# EAGLE design EH4a-midi-v1.4 (poprawiona na przyszłość) (EAGLE 8.6.3)
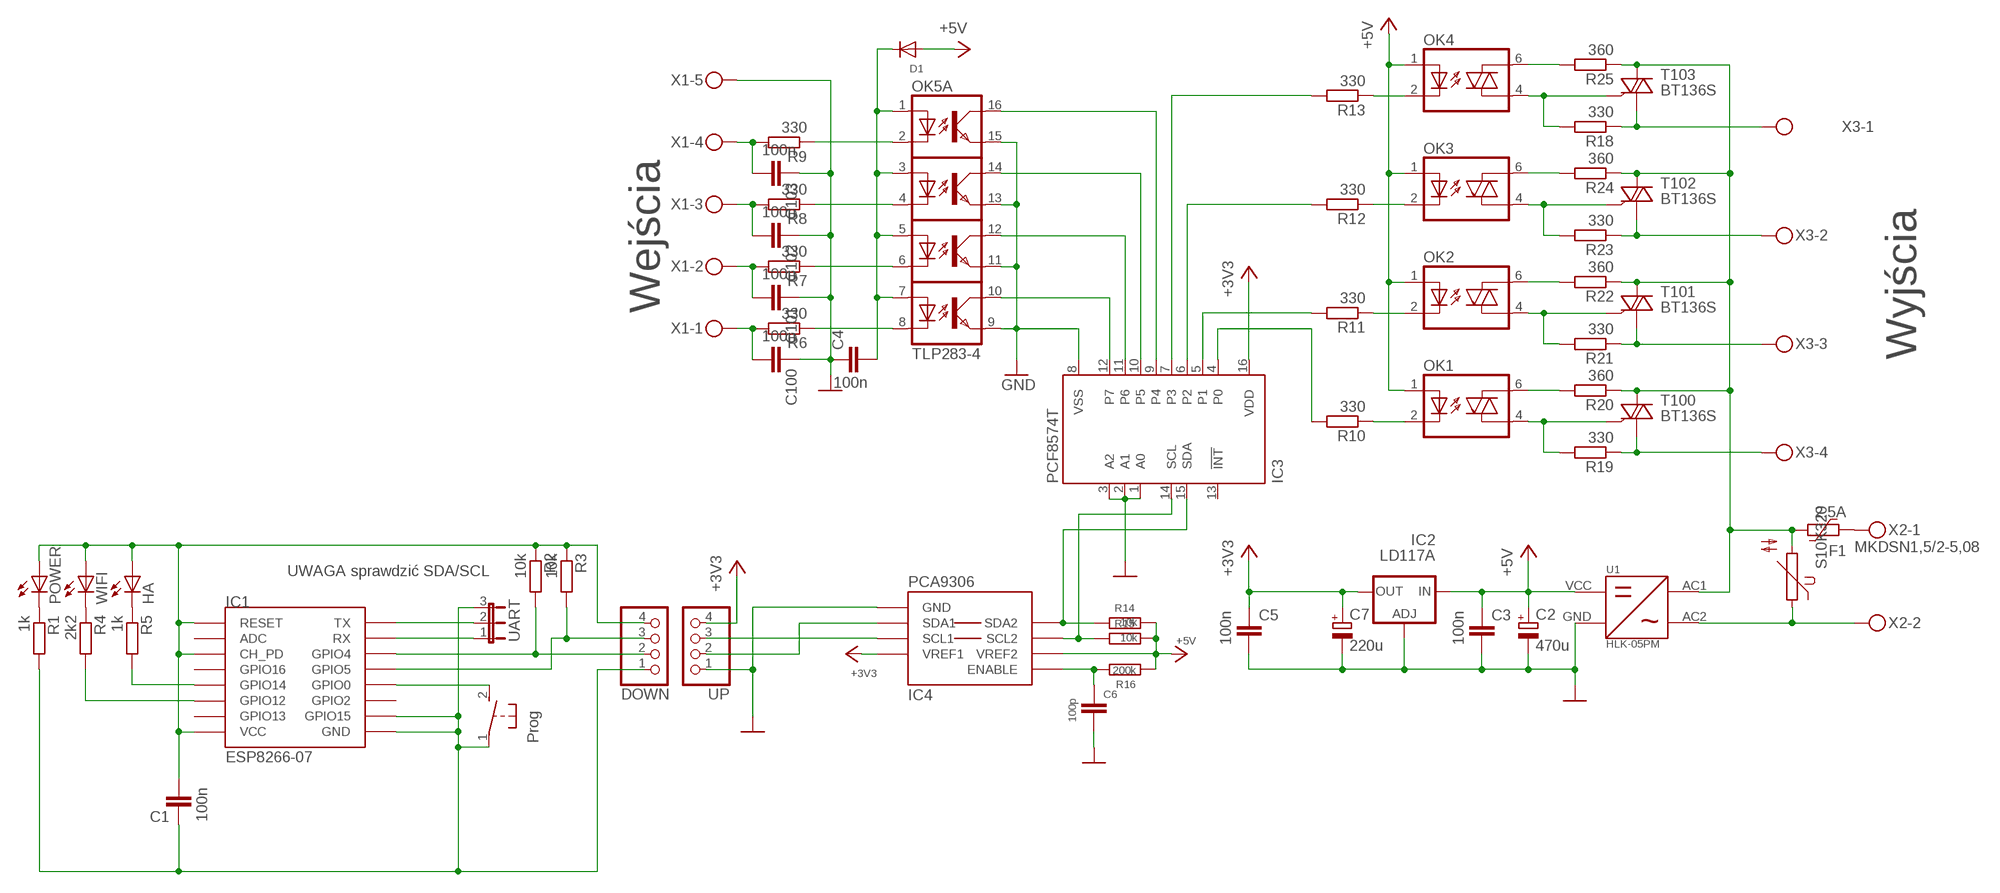
[diagram p0: schematic, sheet 1]

## Parts
C1  100n  C-EUC0805  [C0805]
C2  470u  CPOL-EUE3.5-8  [E3,5-8]
C3  100n  C-EUC0805  [C0805]
C4  100n  C-EUC0805  [C0805]
C5  100n  C-EUC0805  [C0805]
C6  100p  C-EUC0805  [C0805]
C7  220u  CPOL-EUE2.5-7  [E2,5-7]
C100  100n  C-EUC0805  [C0805]
C101  100n  C-EUC0805  [C0805]
C102  100n  C-EUC0805  [C0805]
C103  100n  C-EUC0805  [C0805]
D1  1N4148  DIODESOD-123  [SOD-123]
DOWN  PINHD-1X4  [1X04]
F1  2.5A  2920L700SL  [2920L]
HA  LED3MM  [LED3MM]
IC1  ESP8266-07  ESP12  [ESP12]
IC2  LD117A  LD117AS12TR  [SOT223]
IC3  PCF8574T  [SO16W]
IC4  PCA9306  IC2_LEVEL_TRANSLATER  [MSOP08]
OK1  MOC3043  IL420  [DIL06]
OK2  IL420  [DIL06]
OK3  IL420  [DIL06]
OK4  IL420  [DIL06]
OK5  TLP283-4  [MINI-FLAT-16]
POWER  LED3MM  [LED3MM]
R1  1k  R-EU_M0805  [M0805]
R2  10k  R-EU_M0805  [M0805]
R3  10k  R-EU_M0805  [M0805]
R4  2k2  R-EU_M0805  [M0805]
R5  1k  R-EU_M0805  [M0805]
R6  330  R-EU_M0805  [M0805]
R7  330  R-EU_M0805  [M0805]
R8  330  R-EU_M0805  [M0805]
R9  330  R-EU_M0805  [M0805]
R10  330  R-EU_M0805  [M0805]
R11  330  R-EU_M0805  [M0805]
R12  330  R-EU_M0805  [M0805]
R13  330  R-EU_M0805  [M0805]
R14  10k  R-EU_R0805  [R0805]
R15  10k  R-EU_R0805  [R0805]
R16  200k  R-EU_R0805  [R0805]
R17  S10K320  [S10K320]
R18  330  R-EU_R1210  [R1210]
R19  330  R-EU_R1210  [R1210]
R20  360  R-EU_R1210  [R1210]
R21  330  R-EU_R1210  [R1210]
R22  360  R-EU_R1210  [R1210]
R23  330  R-EU_R1210  [R1210]
R24  360  R-EU_R1210  [R1210]
R25  360  R-EU_R1210  [R1210]
S1  Prog  DTSM-3  [DTSM-3]
T100  BT136S  ACT108WDPAK  [SOT428]
T101  BT136S  ACT108WDPAK  [SOT428]
T102  BT136S  ACT108WDPAK  [SOT428]
T103  BT136S  ACT108WDPAK  [SOT428]
U1  HLK-05PM  HLK-PM01_HLK-PM01  [HLK-PM01_HLK-PM01]
UART  JP2E  [JP2]
UP  PINHD-1X4  [1X04]
WIFI  LED3MM  [LED3MM]
X1  MKDSN1,5/5-5,08  [MKDSN1,5/5-5,08]
X2  MKDSN1,5/2-5,08  [MKDSN1,5/2-5,08]
X3  MKDSN1,5/4-5,08  [MKDSN1,5/4-5,08]

## Nets
3V3: C1.2 DOWN.4 HA.A IC1.CH_PD IC1.RESET IC1.VCC POWER.A R2.1 R3.1 WIFI.A
+3V3: C5.1 C7.+ IC2.2(OUT) IC2.4(OUT) IC3.16(VDD) IC4.2(VREF1) UP.4
+5V: C2.+ C3.1 D1.A IC2.3(IN) IC4.7(VREF2) OK1.1(A) OK2.1(A) OK3.1(A) OK4.1(A) R14.1 R15.1 R16.2 U1.VCC
GND: C2.- C3.2 C4.1 C5.2 C6.2 C7.- C100.1 C101.1 C102.1 C103.1 IC2.1(ADJ) IC3.1(A0) IC3.2(A1) IC3.3(A2) IC3.8(VSS) IC4.1(GND) OK5.9(D:EMIT) OK5.11(C:EMIT) OK5.13(B:EMIT) OK5.15(A:EMIT) U1.GND UP.1 X1.5
GND1: C1.1 DOWN.1 IC1.GND IC1.GPIO15 R1.2 S1.1 UART.3
L: F1.1 R17.2 R20.1 R22.1 R24.1 R25.1 T100.MB(LD) T101.MB(LD) T102.MB(LD) T103.MB(LD) U1.AC1
N$1: IC3.7(P3) R13.2
N$2: IC3.10(P5) OK5.14(B:COL)
N$3: IC3.11(P6) OK5.12(C:COL)
N$4: IC3.12(P7) OK5.10(D:COL)
N$5: IC3.6(P2) R12.2
N$6: OK4.2(C) R13.1
N$7: OK1.2(C) R10.1
N$8: OK2.2(C) R11.1
N$9: IC3.5(P1) R11.2
N$10: IC3.4(P0) R10.2
N$11: IC1.GPIO14 R5.2
N$13: R17.1 U1.AC2 X2.2
N$14: C103.2 R9.2 X1.4
N$15: C102.2 R8.2 X1.3
N$16: F1.2 X2.1
N$19: POWER.K(C) R1.1
N$20: R4.1 WIFI.K(C)
N$21: HA.K(C) R5.1
N$22: IC1.GPIO12 R4.2
N$25: IC1.GPIO0 S1.2
N$26: IC1.RX UART.1
N$27: IC1.TX UART.2
N$29: C6.1 IC4.8(ENABLE) R16.1
N$32: IC3.9(P4) OK5.16(A:COL)
N$39: OK3.2(C) R12.1
N$49: C4.2 D1.C OK5.1(A:A) OK5.3(B:A) OK5.5(C:A) OK5.7(D:A)
N$50: OK5.2(A:C) R9.1
N$51: OK5.4(B:C) R8.1
N$52: OK5.6(C:C) R7.1
N$53: OK5.8(D:C) R6.1
N$54: OK1.4(A1) R19.2 T100.3(G)
N$55: R19.1 T100.1(CM) X3.4
N$56: C101.2 R7.2 X1.2
N$57: C100.2 R6.2 X1.1
N$59: OK2.4(A1) R21.2 T101.3(G)
N$60: R21.1 T101.1(CM) X3.3
N$64: OK3.4(A1) R23.2 T102.3(G)
N$65: R23.1 T102.1(CM) X3.2
N$69: OK4.4(A1) R18.2 T103.3(G)
N$70: R18.1 T103.1(CM) X3.1
N$74: OK4.6(A2) R25.2
N$75: OK3.6(A2) R24.2
N$76: OK2.6(A2) R22.2
N$77: OK1.6(A2) R20.2
SCL: IC3.14(SCL) IC4.6(SCL2) R15.2
SCL1: DOWN.3 IC1.GPIO5 R3.2
SCL': IC4.3(SCL1) UP.3
SDA: IC3.15(SDA) IC4.5(SDA2) R14.2
SDA1: DOWN.2 IC1.GPIO4 R2.2
SDA': IC4.4(SDA1) UP.2
Unconnected: IC1.ADC IC1.GPIO2 IC1.GPIO13 IC1.GPIO16 IC3.13(!INT)

## Notes on the sheet
- Wejścia
- Wyjścia
- UWAGA sprawdzić SDA/SCL

## Library data of the parts
C1 C3-C6 C100-C103 = rcl:C-EU: CAPACITOR, European symbol
C2 C7 = rcl:CPOL-EU: POLARIZED CAPACITOR, European symbol; SPICEPREFIX: C
D1 = adafruit:DIODE: Diode SMADIODE - SMA Surface Mount Package 20V 1A Schottky Diode Digikey: 641-1014-6-ND DO-1N4148 - Through Hole Small Current Diode SOD-123 20V 1 A (.5mV Vf) Schottky Diode - Digikey: MBRX120TPMSCT-ND SOD-323 10V 570mA (.38mV Vf, 3ns) Schottky Diode - Digikey: ZLLS410CT-ND SOD-523 30V 30mA Schottky Diode (RB751S-40TE61) - Digikey: RB751S-40TE61CT-ND SOT23-R/W - SOT23 Package (R = Solder Paste/Reflow Ovens, W = Hand-Soldering) BAT54Film 40V 300mA - Digikey: 497-7162-1-ND
DOWN UP = pinhead:PINHD-1X4: PIN HEADER
F1 = polyfuse-smd_20:?: Polyfuse Resettable PTC Source: http://www.littelfuse.com/products/resettable-ptcs.aspx; MF: Littelfuse; MPN: 2920L700SL; OC_FARNELL: unknown; OC_NEWARK: 69W6461
HA POWER WIFI = led:LED: LED OSRAM: - CHIPLED LG R971, LG N971, LY N971, LG Q971, LY Q971, LO R971, LY R971 LH N974, LH R974 LS Q976, LO Q976, LY Q976 LO Q996 - Hyper CHIPLED LW Q18S LB Q993, LB Q99A, LB R99A - SideLED LS A670, LO A670, LY A670, LG A670, LP A670 LB A673, LV A673, LT A673, LW A673 LH A674 LY A675 LS A676, LA A676, LO A676, LY A676, LW A676 LS A679, LY A679, LG A679 - Hyper Micro SIDELED® LS Y876, LA Y876, LO Y876, LY Y876 LT Y87S - SmartLED LW L88C, LW L88S LB L89C, LB L89S, LG L890 LS L89K, LO L89K, LY L89K LS L896, LA L896, LO L896, LY L896 - TOPLED LS T670, LO T670, LY T670, LG T670, LP T670 LSG T670, LSP T670, LSY T670, LOP T670, LYG T670 LG T671, LOG T671, LSG T671 LB T673, LV T673, LT T673, LW T673 LH T674 LS T676, LA T676, LO T676, LY T676, LB T676, LH T676, LSB T676, LW T676 LB T67C, LV T67C, LT T67C, LS T67K, LO T67K, LY T67K, LW E67C LS E67B, LA E67B, LO E67B, LY E67B, LB E67C, LV E67C, LT E67C LW T67C LS T679, LY T679, LG T679 LS T770, LO T770, LY T770, LG T770, LP T770 LB T773, LV T773, LT T773, LW T773 LH T774 LS E675, LA E675, LY E675, LS T675 LS T776, LA T776, LO T776, LY T776, LB T776 LHGB T686 LT T68C, LB T68C - Hyper Mini TOPLED® LB M676 - Mini TOPLED Santana® LG M470 LS M47K, LO M47K, LY M47K Source: http://www.osram.convergy.de LUXEON: - LUMILED® LXK2-PW12-R00, LXK2-PW12-S00, LXK2-PW14-U00, LXK2-PW14-V00 LXK2-PM12-R00, LXK2-PM12-S00, LXK2-PM14-U00 LXK2-PE12-Q00, LXK2-PE12-R00, LXK2-PE12-S00, LXK2-PE14-T00, LXK2-PE14-U00 LXK2-PB12-K00, LXK2-PB12-L00, LXK2-PB12-M00, LXK2-PB14-N00, LXK2-PB14-P00, LXK2-PB14-Q00 LXK2-PR12-L00, LXK2-PR12-M00, LXK2-PR14-Q00, LXK2-PR14-R00 LXK2-PD12-Q00, LXK2-PD12-R00, LXK2-PD12-S00 LXK2-PH12-R00, LXK2-PH12-S00 LXK2-PL12-P00, LXK2-PL12-Q00, LXK2-PL12-R00 Source: www.luxeon.com KINGBRIGHT: KA-3528ASYC Source: www.kingbright.com
IC1 = esp8266modules:ESP12: ESP8266 Wifi module 12
IC2 = v-reg:LD117A?*: Low drop fixed and adjustable positive voltage regulators 1 A Source: http://www.st.com/stonline/products/literature/ds/7194/ld1117axx.pdf
IC3 = micro-philips:PCF8574: I2C-Bus Remote 8-bit I/O expander http://www.semiconductors.philips.com/acrobat_download/datasheets/PCF8574_4.pdf; MPN: PCF8574T/3,512; OC_FARNELL: 1201255; OC_NEWARK: 70R6870
IC4 = srg:IC2_LEVEL_TRANSLATER: I2C Level Translator PCA9306 Data Sheet <http://www.ti.com/lit/ds/symlink/pca9306.pdf> Sparkfun breakout board schematic <http://dlnmh9ip6v2uc.cloudfront.net/datasheets/BreakoutBoards/PCA9306_Breakout.pdf>
OK1-OK4 = optocoupler:IL420: SIEMENS OPTO COUPLER
OK5 = optocoupler:TLP283-4: TOSHIBA PHOTOCOUPLER GaAs IRED & PHOTO-TRANSISTOR Source: http://www.semicon.toshiba.co.jp/td/en/Opto/Photocoupler/en_20050928_TLP283_datasheet.pdf; OC_FARNELL: unknown; OC_NEWARK: unknown
R1-R13 = rcl:R-EU_: RESISTOR, European symbol; SPICEPREFIX: R
R14-R16 R18-R25 = rcl:R-EU_: RESISTOR, European symbol
R17 = varistor:S10K320: VARISTOR
S1 = switch-tact:DTSM-3
T100-T103 = nxp_60:ACT108W: AC Thyristor power switch AC Thyristor power switch in a SOT223 surface-mountable plastic package with self-protective capabilities against low and high energy transients AAL Eindhoven MK
U1 = HLK-PM:HLK-PM01_HLK-PM01: HLK-PM05
UART = jumper:JP2E: JUMPER
X1 = con-phoenix-508:MKDSN1,5/5-5,08: MKDSN 1,5/ 5-5,08 Printklemme Nennstrom: 13,5 A Nennspannung: 250 V Rastermaß: 5,08 mm Polzahl: 5 Anschlussart: Schraubanschluss Montage: Löten Anschlussrichtung Leiter/Platine: 0 ° Artikelnummer: 1729157 Source: http://eshop.phoenixcontact.com .. 1729157.pdf
X2 = con-phoenix-508:MKDSN1,5/2-5,08: MKDSN 1,5/ 2-5,08 Printklemme Nennstrom: 13,5 A Nennspannung: 250 V Rastermaß: 5,08 mm Polzahl: 2 Anschlussart: Schraubanschluss Montage: Löten Anschlussrichtung Leiter/Platine: 0 ° Artikelnummer: 1729128 Source: http://eshop.phoenixcontact.com .. 1729128.pdf
X3 = con-phoenix-508:MKDSN1,5/4-5,08: MKDSN 1,5/ 4-5,08 Printklemme Nennstrom: 13,5 A Nennspannung: 250 V Rastermaß: 5,08 mm Polzahl: 4 Anschlussart: Schraubanschluss Montage: Löten Anschlussrichtung Leiter/Platine: 0 ° Artikelnummer: 1729144 Source: http://eshop.phoenixcontact.com .. 1729144.pdf

## Board
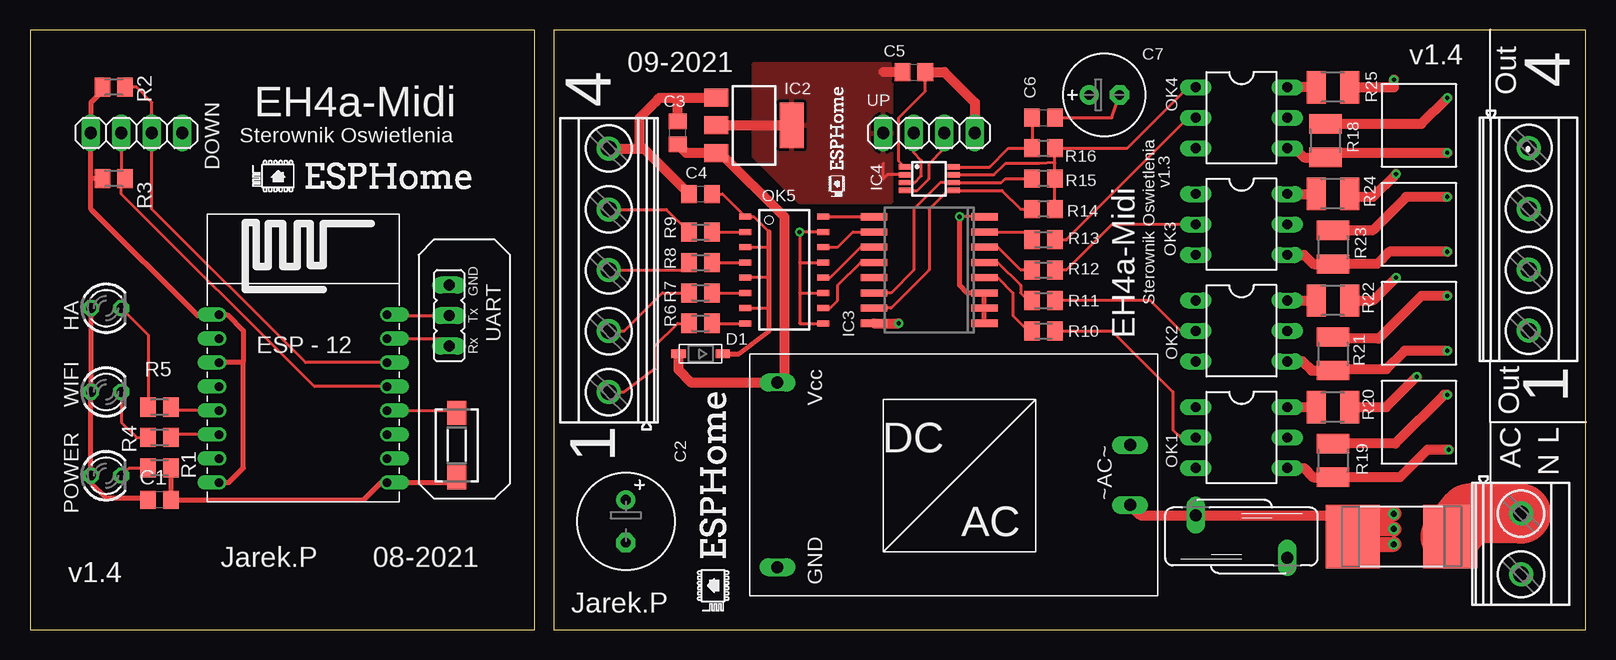
[diagram p1: board, top side]
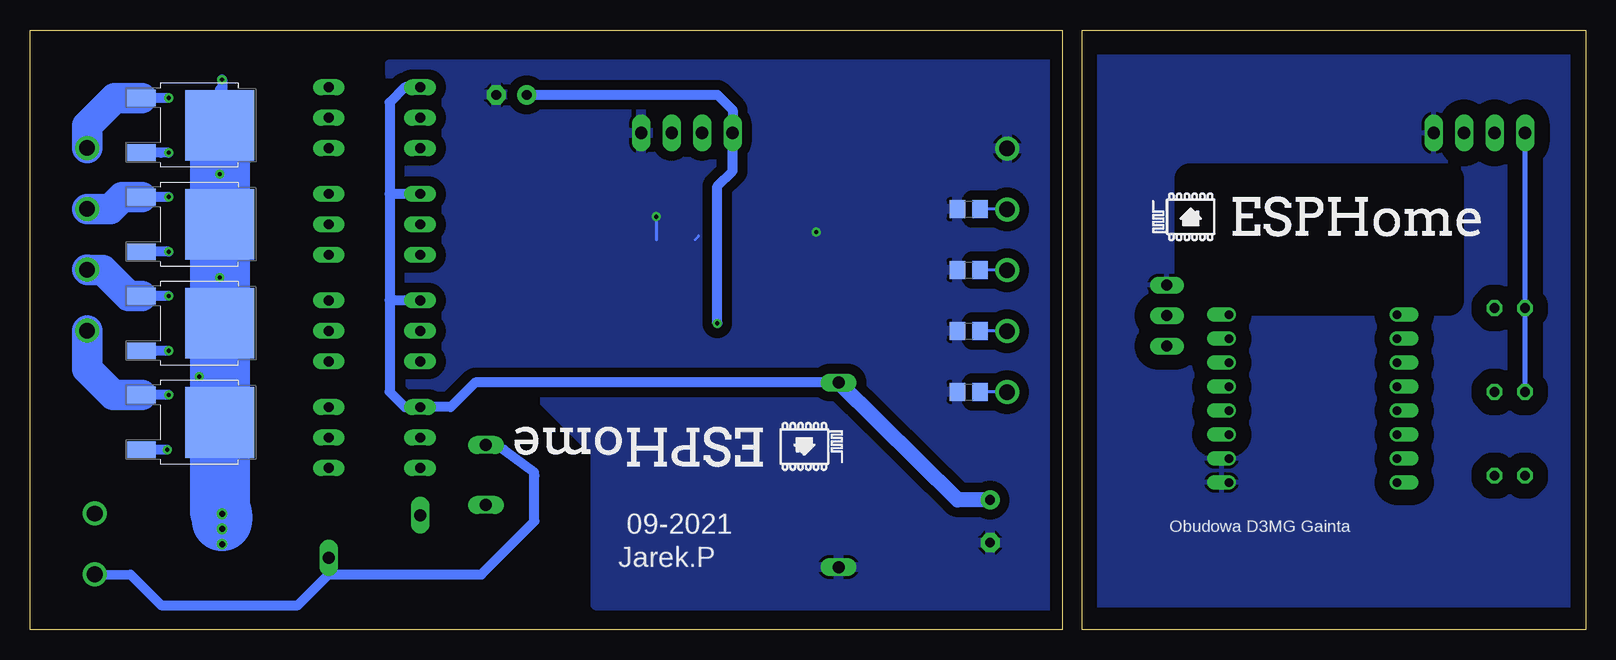
[diagram p2: board, bottom side, seen from below]

Size 129.66 x 50 mm. Coordinates in mm from the lower left corner, seen from the top.
Outline: 129.66,0 129.66,50 43.63,50 43.63,0 129.66,0
Outline: 42,50 42,0 0,0 0,50 42,50
Copper layers (1*16): Top 0.035mm / dielectric 1.5mm / Bottom 0.035mm
Design rules "default *": minimum track width 10mil, minimum drill 10mil, track to track 8mil, track to pad 8mil, pad to pad 6mil, via to via 8mil, smd to smd 6mil, copper to edge 40mil, drill to drill 8mil, minimum pad ring 10mil, minimum via ring 8mil, stop-mask expansion 4mil, vias tented up to drill 0mil, thermal gap 10mil
bRestrict: area 11.4,27.4 to 33,37.6

### Footprints (pad centres in the part's own frame; a part is rotated, then mirrored left to right if it is on the bottom)
C0805 = smd 1.3 x 1.5: 1 -0.95,0; 2 0.95,0
E3,5-8 = drill 0.813 pad 1.6: + -1.778,0 | drill 0.813 pad 1.6 octagon: - 1.778,0
E2,5-7 = drill 0.813 pad 1.6: + -1.27,0 | drill 0.813 pad 1.6 octagon: - 1.27,0
SOD-123 = smd 1.2 x 0.7: A 1.85,0; C -1.85,0
1X04 = drill 1.016 long: 1 -3.81,0; 2 -1.27,0; 3 1.27,0; 4 3.81,0
2920L = smd 4.5 x 5.3: 1 -2.792,0; 2 5.332,0
LED3MM = drill 0.813 octagon: A -1.27,0; K 1.27,0
ESP12 = drill 0.7 offset: ADC -7.1,3.8; CH_PD -7.1,1.8; GND 6.9,-8.2; GPIO0 6.9,-2.2; GPIO2 6.9,-4.2; GPIO4 6.9,1.8; GPIO5 6.9,-0.2; GPIO12 -7.1,-4.2; GPIO13 -7.1,-6.2; GPIO14 -7.1,-2.2; GPIO15 6.9,-6.2; GPIO16 -7.1,-0.2; RESET -7.1,5.8; RX 6.9,3.8; TX 6.9,5.8; VCC -7.1,-8.2
SOT223 = smd 1.5 x 2: 1 -2.3,-3.15; 2 0,-3.15; 3 2.3,-3.15 | smd 3.8 x 2: 4 0,3.15
SO16W = smd 0.6 x 2.2: 1 -4.445,-4.6; 2 -3.175,-4.6; 3 -1.905,-4.6; 4 -0.635,-4.6; 5 0.635,-4.6; 6 1.905,-4.6; 7 3.175,-4.6; 8 4.445,-4.6; 9 4.445,4.6; 10 3.175,4.6; 11 1.905,4.6; 12 0.635,4.6; 13 -0.635,4.6; 14 -1.905,4.6; 15 -3.175,4.6; 16 -4.445,4.6
MSOP08 = smd 0.45 x 1: 1 -0.975,-2.05; 2 -0.325,-2.05; 3 0.325,-2.05; 4 0.975,-2.05; 5 0.975,2.05; 6 0.325,2.05; 7 -0.325,2.05; 8 -0.975,2.05
DIL06 = drill 0.813 long: 1 -2.54,-3.81; 2 0,-3.81; 3 2.54,-3.81; 4 2.54,3.81; 5 0,3.81; 6 -2.54,3.81
MINI-FLAT-16 = smd 1 x 0.5: 1 -3.24,4.445; 2 -3.24,3.175; 3 -3.24,1.905; 4 -3.24,0.635; 5 -3.24,-0.635; 6 -3.24,-1.905; 7 -3.24,-3.175; 8 -3.24,-4.445; 9 3.24,-4.445; 10 3.24,-3.175; 11 3.24,-1.905; 12 3.24,-0.635; 13 3.24,0.635; 14 3.24,1.905; 15 3.24,3.175; 16 3.24,4.445
M0805 = smd 1.3 x 1.6: 1 -0.95,0; 2 0.95,0
R0805 = smd 1.3 x 1.5: 1 -0.95,0; 2 0.95,0
S10K320 = drill 1.016 long: 1 -1.778,-3.81; 2 1.778,3.81
R1210 = smd 1.6 x 2.7: 1 -1.4,0; 2 1.4,0
DTSM-3 = smd 2 x 1.6: 1 -2.7,0; 2 2.7,0
SOT428 = smd 1.4 x 2.4: 1 -2.285,-4.8; 3 2.285,-4.8 | smd 5.9 x 5.75: MB 0,1.725
HLK-PM01_HLK-PM01 = drill 1 long: AC1 -14.21,2.44; AC2 -14.21,-2.56; GND 15.19,7.64; VCC 15.19,-7.76
JP2 = drill 0.914 long: 1 -2.54,0; 2 0,0; 3 2.54,0
MKDSN1,5/5-5,08 = drill 1.3 pad 2: 1 -10.181,0.025; 2 -5.101,0.025; 3 -0.021,0.025; 4 5.059,0.025; 5 10.139,0.025
MKDSN1,5/2-5,08 = drill 1.3 pad 2: 1 -2.561,0.025; 2 2.519,0.025
MKDSN1,5/4-5,08 = drill 1.3 pad 2: 1 -7.641,0.025; 2 -2.561,0.025; 3 2.519,0.025; 4 7.599,0.025

### Placement (x,y rotation side)
C1  10.79,10.8 180 top
C2  49.65,9.03 270 top
C3  53.97,41.41 90 top
C4  55.88,36.33 0 top
C5  73.66,46.49 0 top
C6  84.45,42.68 0 top
C7  89.53,44.59 0 top
C100  51.43,19.82 0 bottom
C101  51.43,24.9 0 bottom
C102  51.43,29.98 0 bottom
C103  51.43,35.06 0 bottom
D1  55.88,23 180 top
DOWN  8.88,41.41 180 top
F1  113.02,7.76 0 top
HA  6.34,26.8 0 top
IC1  22.85,20.45 0 top
IC2  60.32,42.05 270 top
IC3  74.92,29.98 90 top
IC4  74.92,37.6 270 top
OK1  100.96,16.01 270 top
OK2  100.96,24.9 270 top
OK3  100.96,33.79 270 top
OK4  100.96,42.68 270 top
OK5  62.86,29.98 0 top
POWER  6.34,12.84 0 top
R1  10.79,13.47 0 top
R2  6.98,45.22 0 top
R3  6.98,37.6 0 top
R4  10.79,16.01 0 top
R5  10.79,18.55 0 top
R6  55.88,25.54 180 top
R7  55.88,28.07 180 top
R8  55.88,30.61 180 top
R9  55.88,33.16 180 top
R10  84.45,24.9 180 top
R11  84.45,27.44 180 top
R12  84.45,29.98 180 top
R13  84.45,32.52 180 top
R14  84.45,35.06 180 top
R15  84.45,37.6 180 top
R16  84.45,40.14 0 top
R17  100.96,7.76 90 top
R18  107.94,40.77 270 top
R19  108.58,14.11 270 top
R20  108.58,18.55 180 top
R21  108.58,23 270 top
R22  108.58,27.44 180 top
R23  108.58,31.88 270 top
R24  108.58,36.33 180 top
R25  108.58,45.22 180 top
S1  35.55,15.38 90 top
T100  115.56,17.28 270 bottom
T101  115.56,25.54 270 bottom
T102  115.56,33.79 270 bottom
T103  115.56,42.05 270 bottom
U1  77.47,12.84 180 top
UART  34.92,26.17 90 top
UP  74.92,41.41 180 top
WIFI  6.34,19.82 0 top
X1  48.25,29.98 90 top
X2  124.24,7.12 270 top
X3  124.87,32.52 270 top

### Tracks (layer width: path | path; a pad name or v marks a point on that pad's centre or on a via)
3V3
  Top 0.406: 5.07,37.6 5.07,35.06 13.96,26.17 16.42,26.25 | 5.07,37.6 DOWN.4 5.07,43.95 6.03,44.91 R2.1 | IC1.RESET 16.42,26.25 | 16.42,26.25 17.77,24.9 17.77,22.36 | 17.77,22.36 17.67,22.25 IC1.CH_PD | IC1.VCC 16.56,12.26 17.77,13.47 17.77,22.36 | C1.2 9.71,10.93 6.34,10.93 5.07,12.2 POWER.A WIFI.A HA.A | R3.1 5.07,37.6
  Bottom 0.406: WIFI.A DOWN.4
+3V3  (via drill 0.35)
  Top 0.254: IC4.2 71.44,37.92 71.11,37.6 71.11,38.87
  Top 0.813: IC2.2 IC2.4 | C5.1 71.11,46.49 | IC3.16 v72.38,25.54
  Bottom 0.813: C7.+ 72.38,44.59 71.11,43.31 UP.4 71.11,38.23 72.38,36.97 v72.38,25.54
  pour Top: 60.32,47.12 60.32,39.51 64.13,35.7 71.75,35.7 71.75,47.12
+5V
  Top 0.254: IC4.7 80.33,37.92 81.28,38.87 84.07,38.87 85.4,38.94 | 85.4,38.94 R15.1 R14.1 | 85.4,38.94 R16.2 91.44,40.14 96.52,45.22 OK4.1
  Top 0.406: 55.11,20.58 55.38,20.59 | IC2.3 57.54,39.74 | 62.86,20.59 U1.VCC
  Top 0.813: D1.A 54.02,21.67 55.11,20.58 | 55.38,20.59 U1.VCC | 57.54,39.74 62.86,34.42 62.86,20.59 | IC2.3 54.68,39.74 C3.1
  Bottom 0.813: OK4.1 98.42,45.22 99.69,43.95 99.69,36.33 | OK3.1 99.69,36.33 | 99.69,36.33 99.69,27.44 | OK2.1 99.69,27.44 | 99.69,27.44 99.69,19.82 98.42,18.55 OK1.1 94.61,18.55 92.56,20.59 U1.VCC
  Bottom 1.27: C2.+ 52.36,10.8 U1.VCC
GND  (via drill 0.35)
  Top 0.254: OK5.15 v64.13,33.16 64.13,30.61 | 64.13,30.61 OK5.13 | 64.13,30.61 64.13,28.07 | 64.13,28.07 OK5.11 | 64.13,28.07 64.13,25.54 OK5.9 | IC3.8 v77.47,34.42 | IC4.1 72.38,39.06 72.38,42.68 74.6,44.9 C5.2 | C6.2 90.16,42.68 C7.-
  Top 0.406: IC3.1 IC3.2 IC3.3 78.1,28.07 77.47,28.71 v77.47,34.42
  Top 0.813: C4.1 51.14,40.12 X1.5 50.77,40.12 50.79,40.14 50.79,42.68 52.06,43.95 52.46,44.34 53.97,44.34 | 53.97,44.34 IC2.1 | C3.2 53.97,44.34 | C5.2 76.19,46.49 78.73,43.95 UP.1
  Bottom 0.254: v77.47,34.42 77.47,32.52 | 74.25,32.52 73.95,32.81
  pour Bottom (isolate 0.813): 44.45,2.04 44.45,47.12 99.69,47.12 99.06,19.82 87.62,19.82 82.54,14.74 82.54,2.04
GND1
  Top 0.406: S1.1 35.13,12.26 IC1.GND 29.26,12.26 27.81,10.8 C1.1 R1.2
  pour Bottom (isolate 1.27): 41.9,2.04 41.9,47.76 -0.01,47.76 -0.01,2.04
L  (via drill 0.35, 0.5)
  Top 0.813: 109.74,18.31 R20.1 113.02,18.55 v115.56,21.09 | R24.1 110.22,36.09 | 110.22,36.09 109.85,36.33 | R25.1 113.66,45.22 v113.66,45.85 | 110.22,36.09 111.92,36.09 v113.84,37.98 | R22.1 111.94,27.44 v113.84,29.34 | U1.AC1 92.54,9.53 R17.2 108.45,9.53 F1.1 111.12,7.76 | 111.75,9.66 111.75,8.39 111.12,7.76 | 111.12,7.76 111.75,7.12
  Top 1.27: 111.75,7.12 v113.66,7.12 | v113.66,8.39 111.75,8.39 | 111.75,9.66 v113.66,9.66
  Bottom 0.406: T100.MB 113.66,16.82 v115.56,21.09
  Bottom 0.813: v113.66,45.85 113.66,44.86 | 113.66,44.59 113.66,44.86 | 113.66,44.86 113.84,45.04 T103.MB
  Bottom 5: T103.MB v113.84,37.98 v113.84,29.34 | T102.MB v113.84,29.34 | v113.84,29.34 T101.MB T100.MB 113.84,9.84 v113.66,9.66 113.66,9.03
N$1
  Top 0.254: IC3.7 82.86,33.16 R13.2
N$2
  Top 0.254: IC3.10 68.57,33.16 67.3,31.88 OK5.14
N$3
  Top 0.254: OK5.12 66.67,29.34 69.21,31.88 IC3.11
N$4
  Top 0.254: OK5.10 66.67,26.8 67.3,27.44 67.3,28.71 69.21,30.61 IC3.12
N$5
  Top 0.254: IC3.6 80.64,31.88 82.54,29.98 R12.2
N$6
  Top 0.254: R13.1 86.35,32.52 96.52,42.68 OK4.2
N$7
  Top 0.254: R10.1 90.16,24.9 95.25,19.82 95.25,16.64 95.88,16.01 OK1.2
N$8
  Top 0.254: OK2.2 95.88,24.9 93.34,27.44 R11.1
N$9
  Top 0.254: IC3.5 80.64,30.61 82.54,28.71 82.54,28.07 83.18,27.44 R11.2
N$10
  Top 0.254: IC3.4 80.64,29.34 81.91,28.07 81.91,26.17 83.18,24.9 R10.2
N$11
  Top 0.254: IC1.GPIO14 11.4,18.25 R5.2
N$13
  Bottom 0.813: X2.2 121.28,4.58 118.74,2.04 107.33,2.04 104.77,4.6 | 104.77,4.6 92.05,4.6 87.62,9.03 87.62,12.84 87.64,13.11 90.16,14.99 90.82,15.39 U1.AC2 | R17.1 104.77,4.6
N$14
  Top 0.254: X1.4 53.04,35.04 R9.2
  Bottom 0.254: X1.4 48.25,35.06 C103.2
N$15
  Top 0.254: X1.3 54.27,29.96 R8.2
  Bottom 0.254: X1.3 48.25,29.98 C102.2
N$16
  Top 0.813: F1.2 118.11,7.5 118.11,5.85
  Top 5: X2.1 119.9,9.68 F1.2
N$19
  Top 0.254: POWER.K 8.25,13.47 R1.1
N$20
  Top 0.254: WIFI.K 7.61,17.28 8.88,16.01 R4.1
N$21
  Top 0.254: HA.K 9.84,24.58 R5.1
N$22
  Top 0.254: R4.2 11.74,16.32 11.67,16.25 IC1.GPIO12
N$25
  Top 0.254: S1.2 35.38,18.25 IC1.GPIO0
N$26
  Top 0.254: IC1.RX 35.54,24.25 UART.1
N$27
  Top 0.254: IC1.TX 29.92,26.25 29.84,26.17 UART.2
N$29
  Top 0.254: IC4.8 79.96,38.58 81.53,40.14 R16.1 C6.1
N$32
  Top 0.254: OK5.16 IC3.9
N$39
  Top 0.254: OK3.2 90.16,33.79 86.35,29.98 R12.1
N$49
  Top 0.254: OK5.7 61.59,26.8 61.59,29.34 | 61.59,29.34 OK5.5 | OK5.3 61.59,31.88 | 61.59,31.88 61.59,29.34 | 61.59,31.88 61.59,33.16 60.32,34.42 OK5.1 57.71,36.33 C4.2
  Top 0.406: D1.C 59.05,23 61.59,24.9 61.59,26.8 61.59,33.16
N$50
  Top 0.254: R9.1 OK5.2
N$51
  Top 0.254: R8.1 OK5.4
N$52
  Top 0.254: R7.1 OK5.6
N$53
  Top 0.254: R6.1 OK5.8
N$54  (via drill 0.35)
  Top 0.813: OK1.4 106.17,13.47 106.93,12.71 108.71,12.71 R19.2 114.16,12.71 116.45,14.99 v118.23,14.99
  Bottom 0.813: v118.23,14.99 118.87,14.99 T100.3
N$55  (via drill 0.35)
  Top 0.813: v118.11,19.57 117.85,19.57 113.79,15.5 R19.1
  Bottom 0.813: v118.11,19.57 120.62,19.57 T100.1
  Bottom 2.54: T100.1 122.71,19.57 124.9,21.75 X3.4
N$56
  Top 0.254: 54.92,27.76 R7.2 52.7,28.07 49.5,24.88 X1.2
  Bottom 0.254: X1.2 48.25,24.9 C101.2
N$57
  Top 0.254: X1.1 48.25,19.82 49.52,19.82 52.06,21.73 52.06,23.63 53.97,25.54 54.61,25.54 54.92,25.22 R6.2
  Bottom 0.254: X1.1 48.25,19.82 C100.2
N$59  (via drill 0.35)
  Top 0.813: OK2.4 106.04,22.36 106.8,21.6 108.71,21.59 R21.2 108.71,21.73 113.02,21.73 114.55,23.25 v118.11,23.25
  Bottom 0.813: v118.11,23.25 118.74,23.25 T101.3
N$60  (via drill 0.35)
  Top 0.813: v118.11,27.82 115.95,27.82 112.39,24.27 108.71,24.27 R21.1
  Bottom 0.813: v118.11,27.82 119.98,27.82 T101.1
  Bottom 2.54: X3.3 124.86,29.96 123.58,29.96 121.44,27.82 T101.1
N$64  (via drill 0.35)
  Top 0.813: OK3.4 106.17,31.25 106.93,30.49 108.71,30.48 | 108.71,30.48 R23.2 | v118.11,31.5 113.28,31.5 112.26,30.48 108.71,30.48
  Bottom 0.813: v118.11,31.5 119.98,31.5 T102.3
N$65  (via drill 0.35)
  Top 0.813: R23.1 111.88,33.28 114.68,36.08 v118.11,36.08
  Bottom 0.813: v118.11,36.08 119.98,36.08 T102.1
  Bottom 2.54: T102.1 121.95,36.08 122.97,35.06 124.88,35.06 X3.2
N$69  (via drill 0.35)
  Top 0.813: OK4.4 105.41,40.14 106.17,39.38 R18.2 108.96,39.76 v118.11,39.76
  Bottom 0.813: v118.11,39.76 118.74,39.76 T103.3
N$70  (via drill 0.35)
  Top 0.813: R18.1 115.95,42.17 v118.11,44.33
  Bottom 0.813: v118.11,44.33 119.98,44.33 T103.1
  Bottom 2.54: T103.1 122.59,44.33 124.9,42.02 X3.1
N$74
  Top 0.813: R25.2 OK4.6
N$75
  Top 0.813: OK3.6 R24.2
N$76
  Top 0.813: OK2.6 R22.2
N$77
  Top 0.813: OK1.6 R20.2
SCL
  Top 0.254: R15.2 81.28,37.6 80.95,37.27 IC4.6 75.87,37.27 73.66,35.06 73.66,29.98 71.75,28.07 IC3.14
SCL1
  Top 0.254: IC1.GPIO5 23.69,20.25 7.61,36.33 7.61,37.6 R3.2 7.61,37.91 DOWN.3
SCL'
  Top 0.254: IC4.3 73.71,37.27 74.29,37.85 74.29,39.12 73.66,39.76 UP.3
SDA
  Top 0.254: R14.2 82.54,35.06 80.98,36.62 IC4.5 76.49,36.62 74.92,35.06 74.92,29.98 71.75,26.8 IC3.15
SDA1
  Top 0.254: IC1.GPIO4 22.96,22.25 10.15,35.06 DOWN.2 10.15,43.95 8.88,45.22 R2.2
SDA'
  Top 0.254: IC4.4 73.95,36.62 74.92,37.6 74.92,38.87 76.19,40.14 UP.2

### Text on the board
tNames: v1.4 | 09-2021 | 4 | Out | 4 | EH4a-Midi | Sterownik Oswietlenia | Sterownik Oswietlenia | v1.3 | GND | Tx | EH4a-Midi | Rx | 1 | Out | L | 1 | AC | N | Jarek.P | 08-2021 | v1.4 | Jarek.P
bNames: Obudowa D3MG Gainta | 09-2021 | Jarek.P
tValues: BT136S | BT136S | BT136S | BT136S